# Altium schematic sheet MasterDMX.SchDoc
size A4; SheetNumber: 1; SheetTotal: 2; SPICEModelCacheMFUPUCCV: <root> / <DocumentId>MFUPUCCV</DocumentId> / <CacheFrame Number="0"> / <Model Name="res" Kind="MDL"> / <Text>*Default semiconductor resistor / .MODEL RES R()</Text> / </Model> / <Model Name="cap" Kind="MDL"> / <Text>*Default semiconductor capacitor / .MODEL CAP C()</Text> / </Model> / </CacheFrame> / </root>
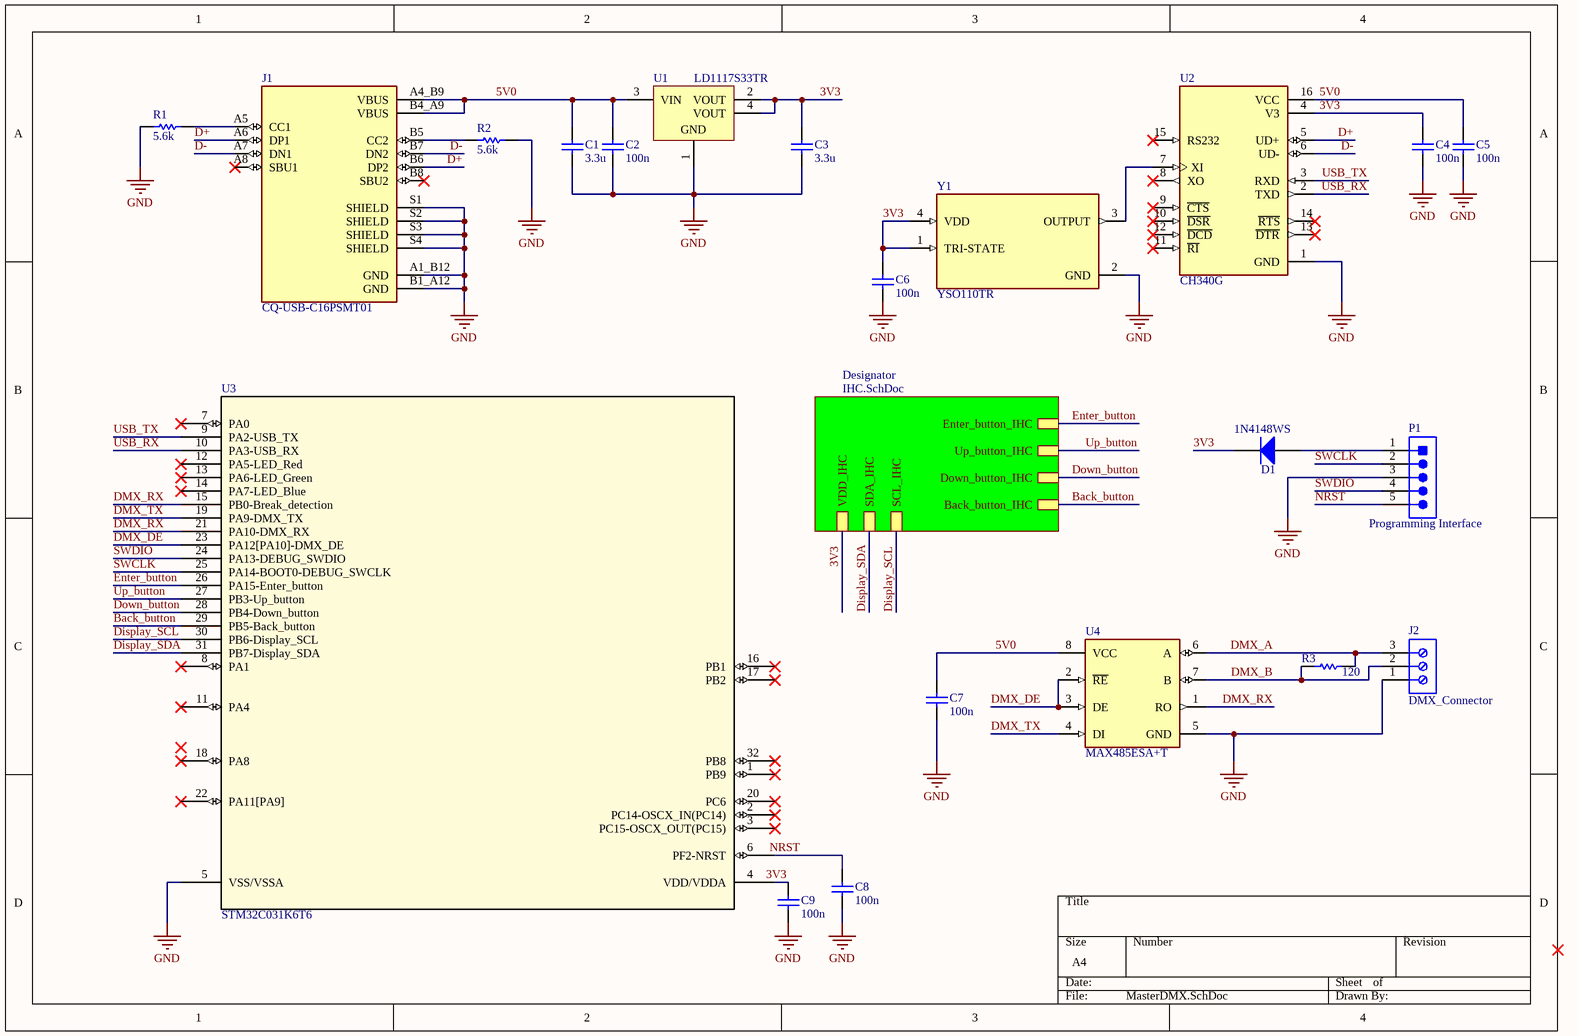
[diagram p0: MasterDMX.SchDoc]

## Parts
C1  3.3u  [C2012[0805]]
C2  100n  [C3216[1206]]
C3  3.3u  [C2012[0805]]
C4  100n  [C3216[1206]]
C5  100n  [C3216[1206]]
C6  100n  [C3216[1206]]
C7  100n  [C3216[1206]]
C8  100n  [C3216[1206]]
C9  100n  [C3216[1206]]
D1  1N4148WS  [FAIR-SOD-323_V]
J1  CQ-USB-C16PSMT01  [SHENZHEN-CHUANGQIN-TECHNOLOGY_CQ-USB-C16PSMT01]
J2  DMX_Connector  [691214110003]
P1  Programming Interface  [FCI-77311-5_V]
R1  5.6k  [R2012[0805]]
R2  5.6k  [R2012[0805]]
R3  120  [R2012[0805]]
U1  LD1117S33TR  [STM-SOT-223_M]
U2  CH340G  [SOIC127P600X180-16N]
U3  STM32C031K6T6  [LQFP32_7X7_STM]
U4  MAX485ESA+T  [FP-S8-2-MFG]
Y1  YSO110TR  [OSC_ECS-TXO-2016-33-120-TR]

## Sub-sheets
Designator = IHC.SchDoc: SDA_IHC, SCL_IHC, VDD_IHC, Back_button_IHC, Down_button_IHC, Up_button_IHC, Enter_button_IHC

## Nets
GND: C1.1 C2.1 C3.1 C4.1 C5.1 C6.1 C7.1 C8.1 C9.1 J1.A1_B12(GND) J1.B1_A12(GND) J1.S1(SHIELD) J1.S2(SHIELD) J1.S3(SHIELD) J1.S4(SHIELD) J2.1 P1.3(TXO) R1.1 R2.2 U1.1(GND) U2.1(GND) U3.5(VSS/VSSA) U4.5(GND) Y1.2(GND)
3V3: C3.2 C4.2 C6.2 C9.2 D1.2(K) U1.2(VOUT) U1.4(VOUT) U2.4(V3) U3.4(VDD/VDDA) Y1.1(TRI-STATE) Y1.4(VDD) ; sheet Designator/VDD_IHC
5V0: C1.2 C2.2 C5.2 C7.2 J1.A4_B9(VBUS) J1.B4_A9(VBUS) U1.3(VIN) U2.16(VCC) U4.8(VCC)
Back_button: U3.29(PB5-Back_button) ; sheet Designator/Back_button_IHC
D+: J1.A6(DP1) J1.B6(DP2) U2.5(UD+)
D-: J1.A7(DN1) J1.B7(DN2) U2.6(UD-)
Display_SCL: U3.30(PB6-Display_SCL) ; sheet Designator/SCL_IHC
Display_SDA: U3.31(PB7-Display_SDA) ; sheet Designator/SDA_IHC
DMX_A: J2.3 R3.1 U4.6(A)
DMX_B: J2.2 R3.2 U4.7(B)
DMX_DE: U3.23(PA12[PA10]-DMX_DE) U4.2(~{RE}) U4.3(DE)
DMX_RX: U3.15(PB0-Break_detection) U3.21(PA10-DMX_RX) U4.1(RO)
DMX_TX: U3.19(PA9-DMX_TX) U4.4(DI)
Down_button: U3.28(PB4-Down_button) ; sheet Designator/Down_button_IHC
Enter_button: U3.26(PA15-Enter_button) ; sheet Designator/Enter_button_IHC
NRST: C8.2 P1.5(CTS) U3.6(PF2-NRST)
SWCLK: P1.2(RXI) U3.25(PA14-BOOT0-DEBUG_SWCLK)
SWDIO: P1.4(VCC) U3.24(PA13-DEBUG_SWDIO)
Up_button: U3.27(PB3-Up_button) ; sheet Designator/Up_button_IHC
USB_RX: U2.2(TXD) U3.10(PA3-USB_RX)
USB_TX: U2.3(RXD) U3.9(PA2-USB_TX)
NetD1_1: D1.1(A) P1.1(DTR)
NetJ1_A5: J1.A5(CC1) R1.2
NetJ1_B5: J1.B5(CC2) R2.1
NetU2_7: U2.7(XI) Y1.3(OUTPUT)

Not connected (* = marked no-connect by the designer): J1 A8(SBU1)* B8(SBU2)*; U2 8(XO)* 9(~{CTS})* 10(~{DSR})* 11(~{RI})* 12(~{DCD})* 13(~{DTR})* 14(~{RTS})* 15(RS232)*; U3 1(PB9)* 2(PC14-OSCX_IN(PC14))* 3(PC15-OSCX_OUT(PC15))* 7(PA0)* 8(PA1)* 11(PA4)* 12(PA5-LED_Red)* 13(PA6-LED_Green)* 14(PA7-LED_Blue)* 16(PB1)* 17(PB2)* 18(PA8)* 20(PC6)* 22(PA11[PA9])* 32(PB8)*

## Library data of the parts
C1-C9 = C: Capacitor; Value: 1; Manufacturer: *; PartNumber: *; Package Type: *
D1 = CMP-004-00001-2: Small Signal Diode, 75 V, 0.15 A, -55 to 150 degC, 2-Pin SOD-323, RoHS, Tape and Reel; Manufacturer: Fairchild; Recovery Time: 4ns; Forward Voltage: 1V; Peak Reverse Current: 5uA; Forward Current: 150mA; Capacitance: -323f; Datasheet URL: https://www.fairchildsemi.com/datasheets/1N/1N4148WS.pdf; Package Reference: SOD-323; Package Description: 2-Pin Small Outline Diode Flat Lead, Body 1.7 x 1.25 mm; Case/Package: SOD-323; Mounting Technology: SM; Manufacturer URL: https://www.fairchildsemi.com/; Pins: 2; Packaging: TapeandReel; Package Quantity: 3000; Min Operating Temperature: -55°C; RoHS Compliant: True; Max Operating Temperature: 150°C; Datasheet Version: Rev. 1.2, 03/2015
J1 = CQ-USB-C16PSMT01: C Type USB Type-C Female Plug 16 Pin Connector Power Charger Jack Port; MF: Shenzen Chuangqin Technology; MP: CQ-USB-C16PSMT01; Price: None; Package: Package; Availability: Unavailable; SnapEDA_Link: https://www.snapeda.com/parts/CQ-USB-C16PSMT01/Shenzen%20Chuangqin%20Technology/view-part/5798994/?ref=snap; Check_prices: https://www.snapeda.com/parts/CQ-USB-C16PSMT01/Shenzen%20Chuangqin%20Technology/view-part/5798994/?ref=eda; Value: *
J2 = CMP-1502-02466-2: NexarPartId: 18818289; Number of Levels: 1; Voltage: 300V; Pitch: 3.5052mm; Stripping Length: -6mm; Number of Positions Per Level: 3; Plating: Brass, Steel; Wire/Cable Gauge: 24AWG; Wire Gauge (Min): 16AWG; Current Rating: 10A; Width: 10.9mm; Length: 7.4mm; Housing Material: Nylon; Height: 12.2mm; Min Operating Temperature: -40°C; Contact Plating: Brass, Tin; Packaging: Box; Color: Blue, Green; Number of Contacts: 3; Number of Pins: 3; Voltage Rating: 300V; Termination: Screw; Lead Pitch: 3.5mm; Max Operating Temperature: 105°C; Mount: Through Hole; Contact Material: Brass; RoHS: Compliant; Wire Gauge (Max): 24AWG; Current: 10A; REACH SVHC: Unknown
P1 = CMP-002-00021-2: Male Header, Pitch 2.54 mm, 1 x 5 Position, Height 16.24 mm, Tail Length 3.05 mm, -65 to 125 degC, RoHS, Tape and Reel; Manufacturer: FCI Electronics; Connector Type: Header; Manufacturer URL: http://portal.fciconnect.com/; Datasheet URL: http://portal.fciconnect.com/Comergent//fci/drawing/77311.pdf; Gender: Male; Case/Package: 77311-5; Package Reference: 77311-5; Datasheet Version: Rev. CK, 07/2016; Package Description: Male Header, Pitch 2.54 mm, 1 x 5 Position, Height 16.24 mm, Tail Length 3.05 mm; RoHS Compliant: Unknown; Mounting Technology: TH
R1-R3 = R: Resistor; Value: 0; Manufacturer: *; PartNumber: *; Package Type: *
U1 = CMP-019-00019-3: Low Drop Positive Voltage Regulator, 800 mA, Fixed 3.3 V Output, 0 to 125 degC, 3-Pin TO-220, RoHS, Tape and Reel; Manufacturer: STMicroelectronics; Max Supply Voltage: 15V; Dropout Voltage: 1.1V; Power: 12W; Output Current: 950mA; Min Input Voltage: 4.75V; Nominal Output Voltage: 3.3V; Max Ouput Current: 1.3A; Outputs: 1; Packaging: TapeandReel; Datasheet Version: Rev. 33, 11/2013; RoHS Compliant: True; Mounting Technology: SM; Max Input Voltage: 15V; Max Operating Temperature: 125°C; Package Reference: SOT-223; Package Quantity: 2500; Package Description: 4-Pin Small Outline Transistor, Body 6.5 x 3.5 mm, Pitch 2.3 mm; Case/Package: TO-261-4; Min Operating Temperature: 0°C; Datasheet URL: http://www.farnell.com/datasheets/1776449.pdf; Min Supply Voltage: 4.75V; Pins: 3; Output Voltage: 3.3V; Manufacturer URL: http://www.st.com/
U2 = CH340G: USB Interface Integrated Circuit; MF: WCH; Value: *; SnapEDA_Link: https://www.snapeda.com/parts/Ch340G/WCH/view-part/?ref=snap; MP: Ch340G; Check_prices: https://www.snapeda.com/parts/Ch340G/WCH/view-part/?ref=eda; Availability: Not in stock; Price: None; Package: None
U3 = STM32C031K6T6: No Description Available; Mfr_Name: STMicroelectronics; RefDes: RefDes; Type: Type
U4 = CMP-015-00008-1: Line Transceiver, 1 Func, 1 Driver, 1 Rcvr, CMOS, PDSO8; Max Supply Voltage: 5.25V; Min Supply Voltage: 4.75V; RoHS Compliant: Yes; Max Operating Temperature: 85°C; Min Operating Temperature: -40°C
Y1 = CMP-003-000000-1: MP: ECS-TXO-2016-33-120-TR; Source: ECS-TXO-2016-33-120-TR.SchLib; Price: None; Design Item ID: ECS-TXO-2016-33-120-TR; Package: None; Value: *; Availability: Unavailable; Component Type: Standard; Pin Count: 4